# EAGLE design stair light psu (EAGLE 6.2)
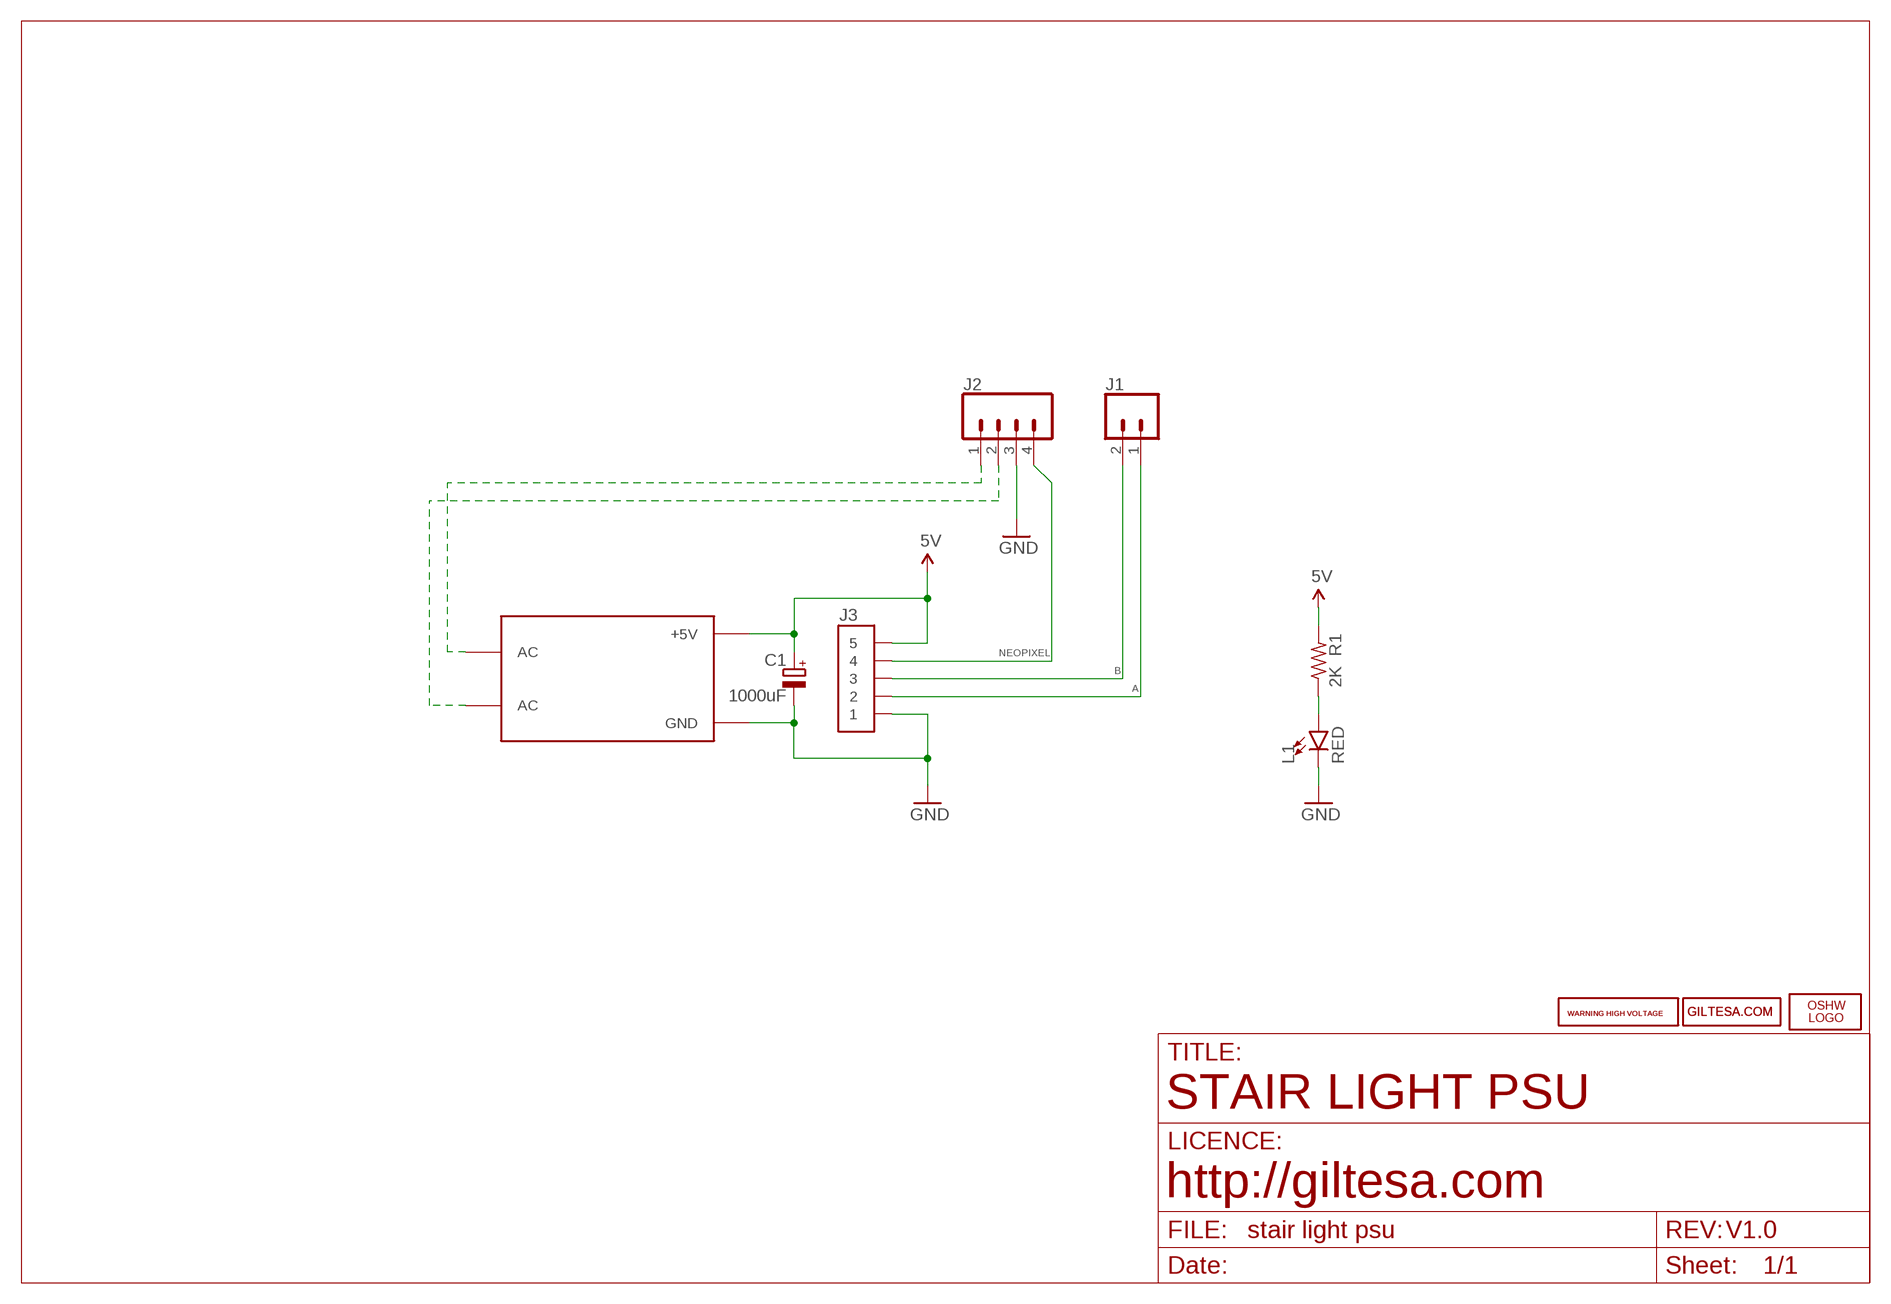
[diagram p0: schematic, sheet 1]

## Parts
C1  1000uF  CPOL-EUB45181A  [B45181A]
J1  TERMINAL_5MM_2P1  [TERMINAL_5MM_2P]
J2  TERMINAL_5MM_4P_90º_20A  [TERMINAL_5MM_4P_90º_20A]
J3  1X05  [1X5_SMT_2MM]
L1  RED  LED-BLUE0603  [LED-0603]
LOGO1  OSHW_LOGO_FILLX0150-NT  [OSHW_FILLX150_NOTEXT]
R1  2K  R0603  [R0603]
U1  HILINK HLK-PM01 5V  HILINK_HLK-PM01_5V  [HILINK_HLK-PM01_5V]
U$3  WARNING_HIGH_VOLTAGE1  [WARNING_HIGH_VOLTAGE]
U$6  WARNING_HIGH_VOLTAGE1  [WARNING_HIGH_VOLTAGE]
U$10  GILTESA.COM_COPPER  [GILTESA.COM_COPPER]
U$13  GILTESA.COM_MASK  [GILTESA.COM_MASK]

## Nets
5V: C1.+ J3.5 R1.2 U1.+5V
A: J1.1 J3.2
B: J1.2 J3.3
GND: C1.- J2.3 J3.1 L1.C U1.GND
N$1: L1.A R1.1
N$5: J2.1 U1.AC@2(AC)
N$6: J2.2 U1.AC@1(AC)
NEOPIXEL: J2.4 J3.4

## Notes on the sheet
- STAIR LIGHT PSU
- http://giltesa.com
- V1.0

## Library data of the parts
C1 = resistor:CPOL-EU: POLARIZED CAPACITOR, European symbol
J1 = ,giltesa:TERMINAL_5MM_2P
J2 = ,giltesa:TERMINAL_5MM_4P_90º_20A
J3 = ,giltesa:1X05
L1 = SparkFun-LED:LED-BLUE: Blue SMD LED Used in manufacturing of various products at SparkFun Packages: 0603 - SMD 0603 package [Product Link] <http://www.digikey.com/product-detail/en/SMLE12BC7TT86/511-1589-2-ND/1641808> 1206 - SMD1206 package [Product Link] <http://www.digikey.com/product-detail/en/lite-on-inc/LTST-C150TBKT/160-1643-1-ND/573584> SparkFun Products: ESP8266 Thing-Dev Board <https://www.sparkfun.com/products/13711> RedBoard <https://www.sparkfun.com/products/12757>; PROD_ID: DIO-08575; VALUE: BLUE
LOGO1 = ohw-logo:OSHW_LOGO_FILL
R1 = ,giltesa:R0603
U1 = ,giltesa:HILINK_HLK-PM01_5V
U$3 U$6 = ,giltesa_logos:WARNING_HIGH_VOLTAGE
U$10 U$13 = ,giltesa_logos:GILTESA.COM

## Net classes
1 power: width 0.178 mm
2 gnd: width 0.305 mm, drill 0.406 mm, clearance 0.203 mm
3 power usb: width 0.508 mm, drill 0.406 mm, clearance 0.203 mm
4 aref: width 0.254 mm, drill 0.61 mm, clearance 0.254 mm

## Board
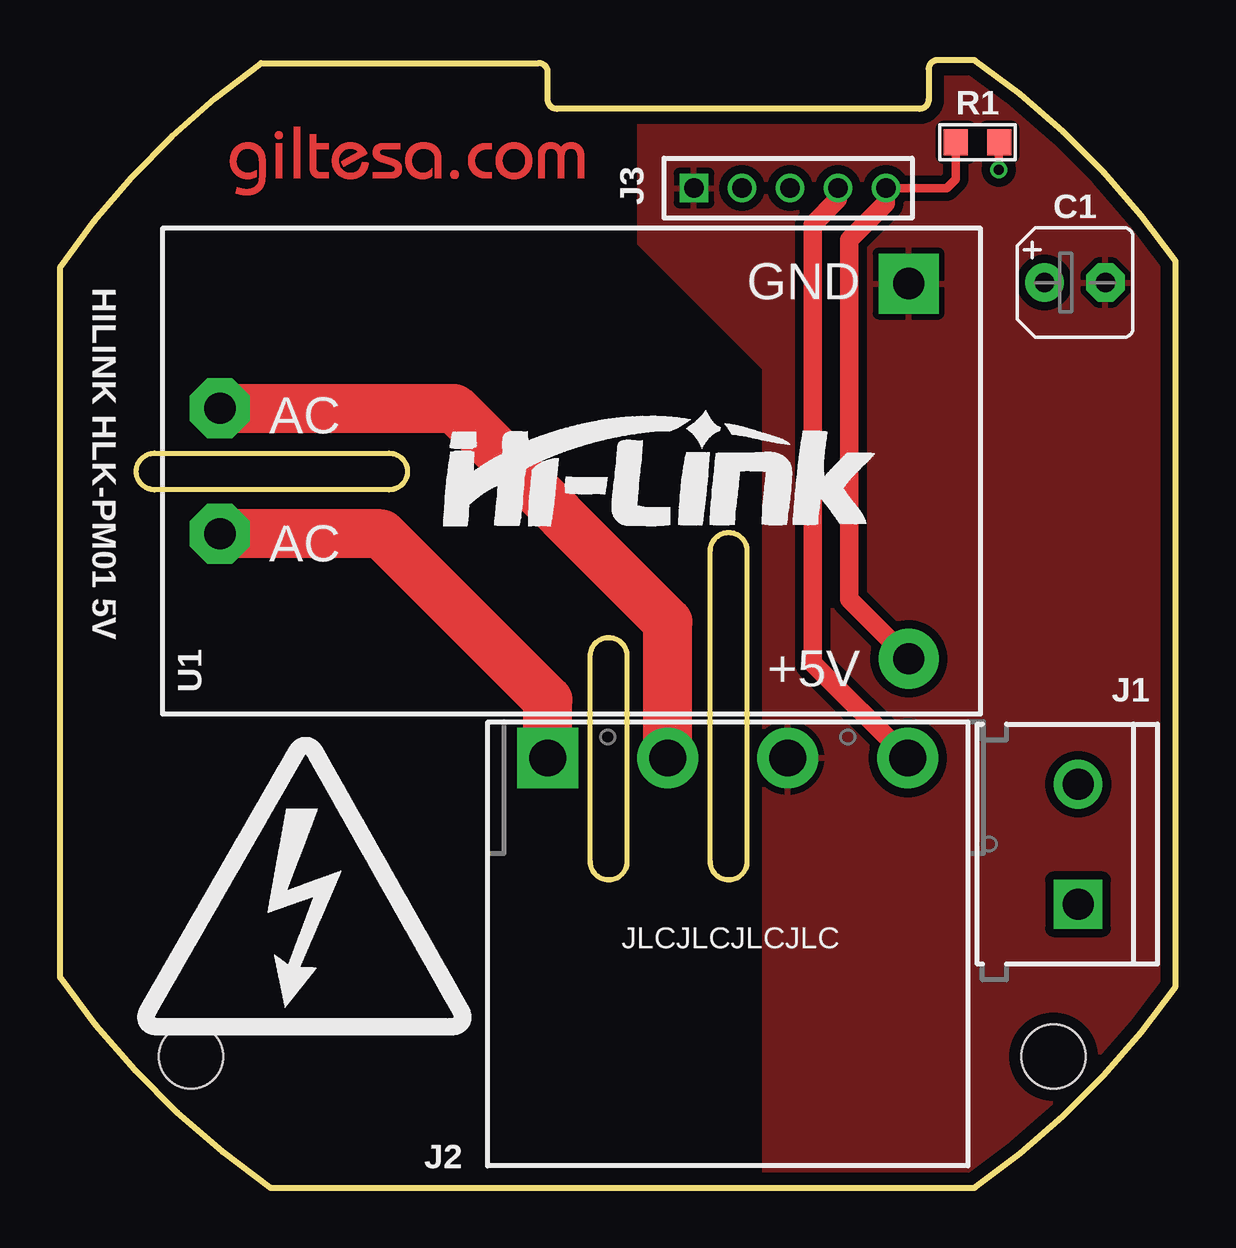
[diagram p1: board, top side]
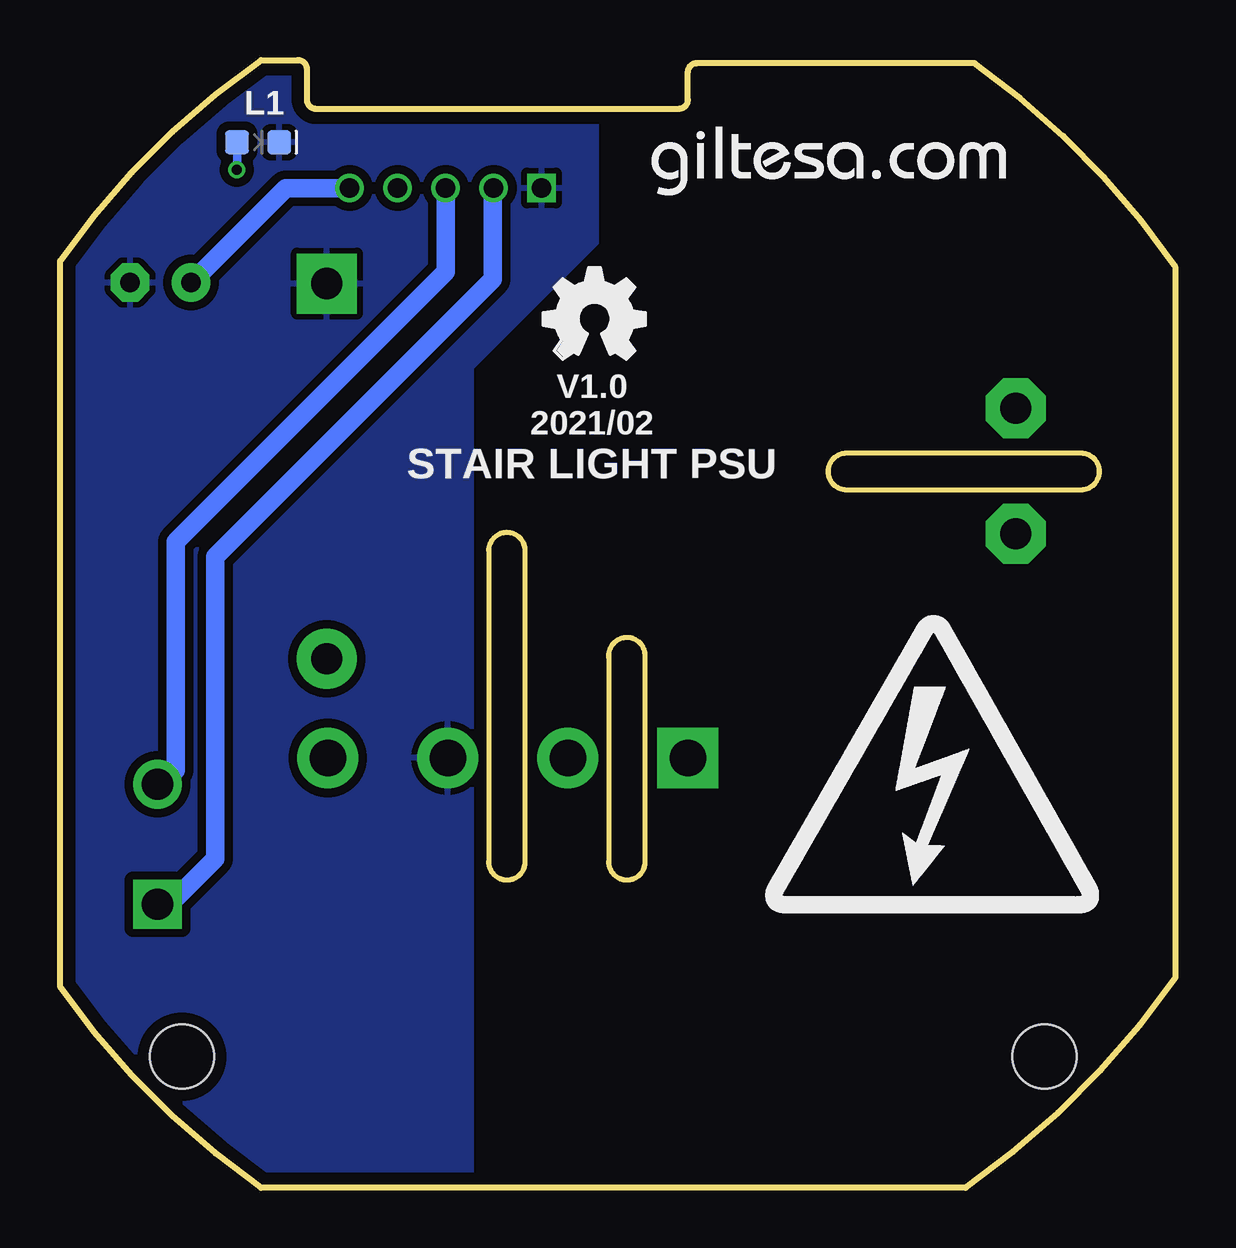
[diagram p2: board, bottom side, seen from below]

Size 46.48 x 46.99 mm. Coordinates in mm from the lower left corner, seen from the top.
Outline: 8.76,0 38.1,0 arc20 46.48,8.38 46.48,38.61 arc20 38.1,46.99 36.58,46.99 arc90 36.2,46.61 36.2,45.34 arc-90 35.81,44.96 20.7,44.96 arc-90 20.32,45.34 20.32,46.48 arc90 19.94,46.86 8.38,46.86 arc20 0,38.35 0,8.76 arc20 8.76,0
Outline: 22.1,22.23 arc-180 23.62,22.1 23.62,13.59 arc-180 22.1,13.59 22.1,22.23
Outline: 27.1,26.54 arc-180 28.62,26.54 28.62,13.59 arc-180 27.1,13.59 27.1,26.54
Outline: 3.94,29.08 arc-180 3.94,30.61 13.72,30.61 arc-180 13.72,29.08 3.94,29.08
Copper layers (1*16): Top 0.035mm / dielectric 1.6mm / Bottom 0.035mm
Design rules: minimum track width 6mil, minimum drill 12mil, track to track 6mil, track to pad 6mil, pad to pad 6mil, via to via 8mil, smd to smd 0mil, copper to edge 20mil, drill to drill 10mil, minimum pad ring 6mil, minimum via ring 6mil, stop-mask expansion 0mil, vias tented up to drill 100mil, thermal gap 10mil
Holes 2.67 mm at 5.46,5.46 41.4,5.46

### Footprints (pad centres in the part's own frame; a part is rotated, then mirrored left to right if it is on the bottom)
B45181A = drill 0.813 pad 1.6: + -1.27,0 | drill 0.813 pad 1.6 octagon: - 1.27,0
TERMINAL_5MM_2P = drill 1.3 pad 2.032 square: 1 0,0 | drill 1.3 pad 2.032: 2 5,0
TERMINAL_5MM_4P_90º_20A = drill 1.524 pad 2.54 square: 1 0.004,0 | drill 1.524 pad 2.54: 2 5.004,0; 3 10.004,0; 4 15.004,0
1X5_SMT_2MM = drill 0.8 square: 1 0,0 | drill 0.8: 2 2,0; 3 4,0; 4 6,0; 5 8,0
LED-0603 = smd 1 x 1: A -0.877,0; C 0.877,0
R0603 = smd 1 x 1.1: 1 -0.901,0; 2 0.901,0
HILINK_HLK-PM01_5V = drill 1.3 pad 2.5: +5V 31.109,2.3 | drill 1.3 pad 2.5 octagon: AC@1 2.409,12.73; AC@2 2.409,7.5 | drill 1.3 pad 2.5 square: GND 31.109,17.93

### Placement (x,y rotation side)
C1  42.29,37.72 0 top
J1  42.42,11.82 90 top
J2  20.32,17.91 0 top
J3  26.42,41.66 0 top
L1  38.23,43.56 0 bottom
LOGO1  26.34,34.52 0 bottom
R1  38.23,43.56 180 top
U1  4.25,19.75 0 top
U$3  3.17,6.35 0 top
U$6  17.14,11.43 0 bottom
U$10  6.99,41.27 0 top
U$13  21.92,41.27 0 bottom

### Tracks (layer width: path | path; a pad name or v marks a point on that pad's centre or on a via)
5V
  Top 0.356: R1.2 37.33,42.02 36.96,41.66 J3.5
  Top 0.762: U1.+5V 32.89,24.52 32.89,39.5 34.42,41.02 J3.5
  Bottom 0.762: J3.5 37.08,41.66 C1.+
A
  Bottom 0.762: J1.1 41.91,11.82 40.01,13.72 40.01,26.29 28.45,37.85 28.45,41.62 J3.2
B
  Bottom 0.762: J3.3 30.42,38.16 41.66,26.92 41.66,17.4 42.24,16.82 J1.2
GND
  pour Bottom (isolate 0.356): 24.13,47.62 24.13,39.37 29.34,34.16 29.34,-0.64 46.99,-0.64 46.99,47.62
  pour Top (isolate 0.356): 24.13,47.62 24.13,39.37 29.34,34.16 29.34,-0.64 46.99,-0.64 46.99,47.62
N$1  (via drill 0.41)
  Top 0.356: v39.12,42.42 39.12,43.55 R1.1
  Bottom 0.356: L1.A 39.1,42.43 v39.12,42.42
N$5
  Top 2.032: U1.AC@2 13.39,27.25 20.32,20.32 J2.1
N$6
  Top 2.032: J2.2 25.32,23.57 16.42,32.48 U1.AC@1
NEOPIXEL
  Top 0.762: J2.4 31.37,21.86 31.37,40.13 32.42,41.18 J3.4

### Text on the board
tPlace: JLCJLCJLCJLC
bPlace: V1.0 | 2021/02 | STAIR LIGHT PSU